# EAGLE schematic fet-dd-charger-20mm-mk-1.0-top (EAGLE 7.5.0)
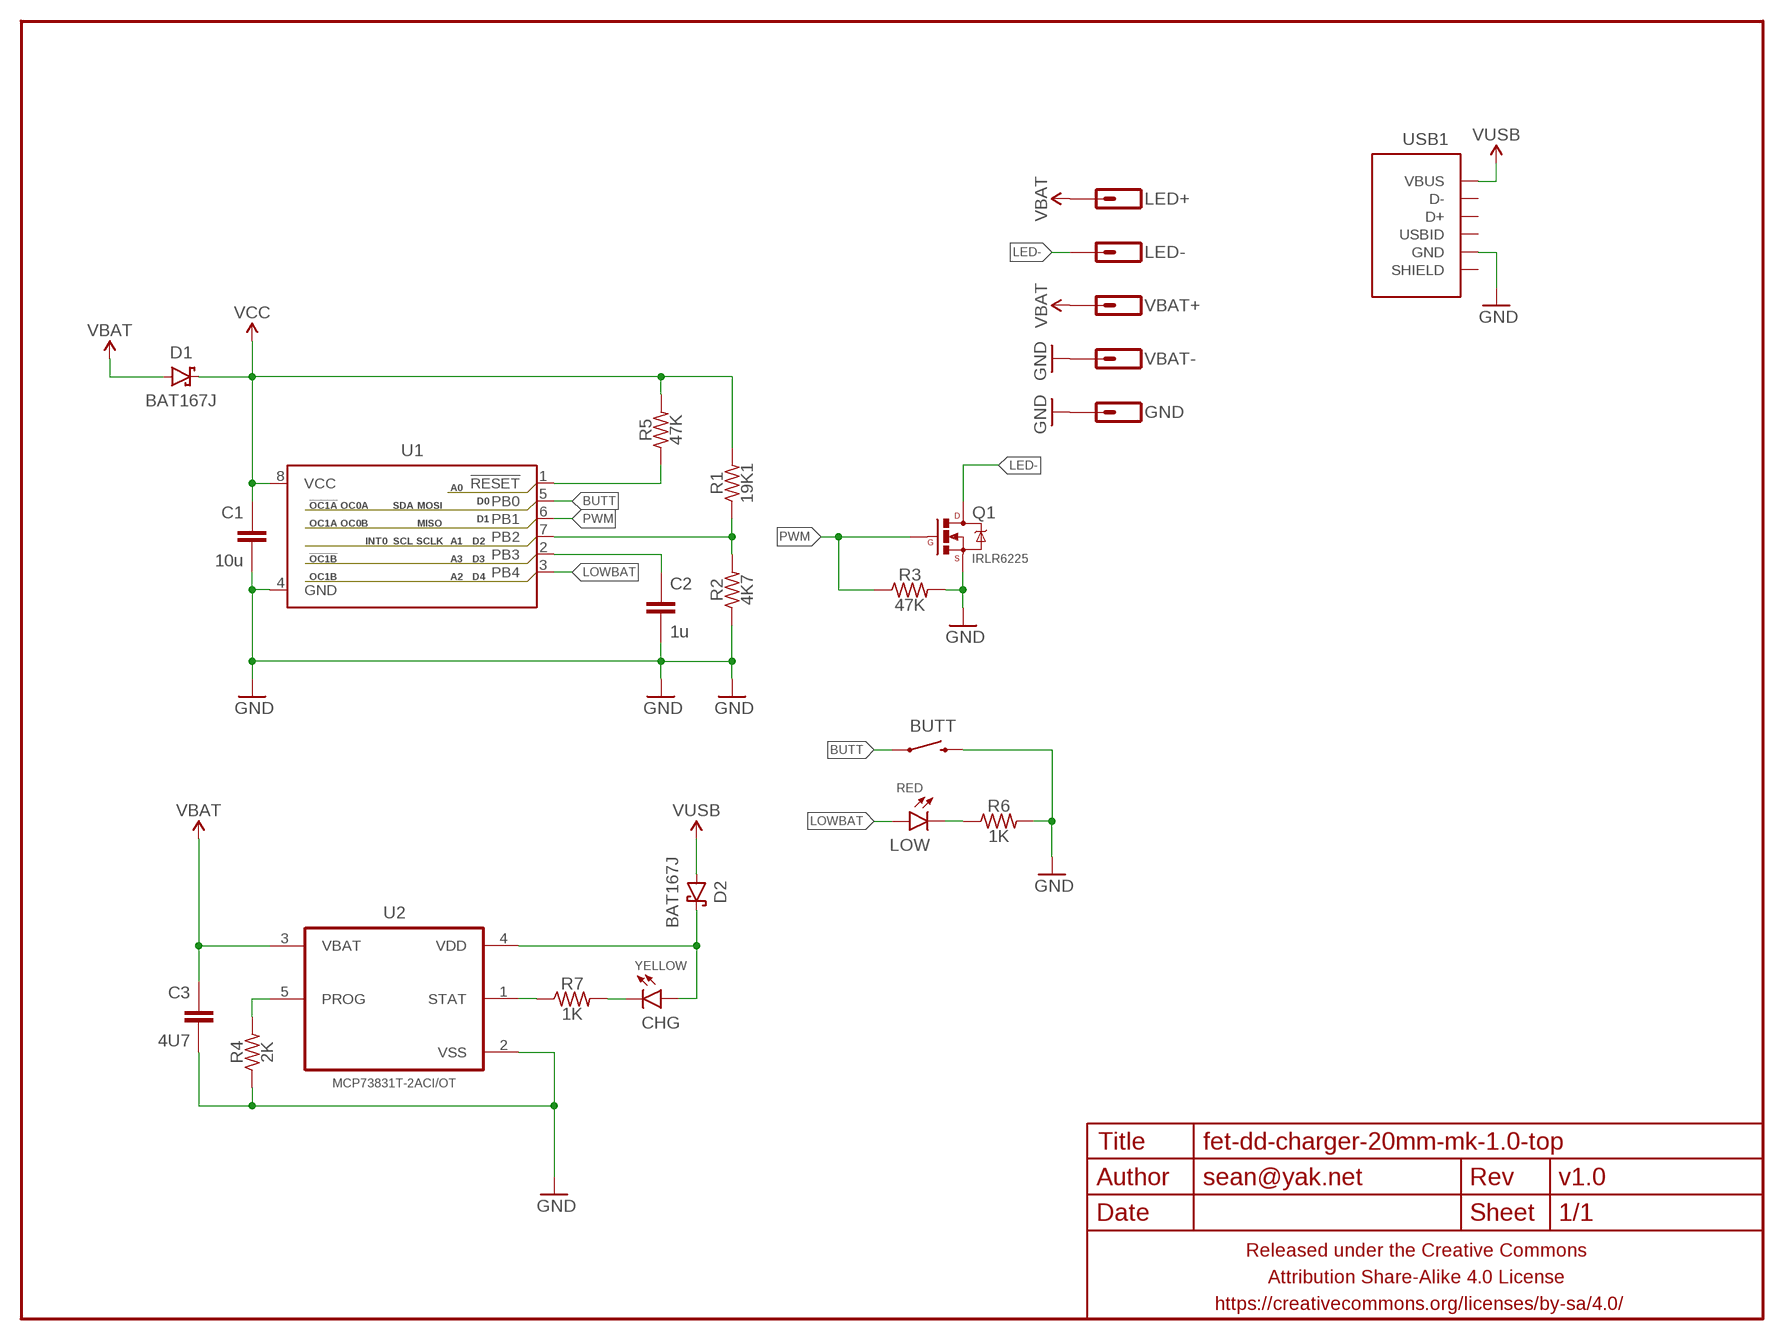
[diagram p0: schematic, sheet 1]

## Parts
BUTT  SWITCH-MOMENTARY-2PTH-RA  [TACTILE-PTH-SIDE]
C1  10u  CAPACITOR-CERAMICC0603-TIGHTER  [C0603-TIGHTER]
C2  1u  CAPACITOR-CERAMICC0603-TIGHTER  [C0603-TIGHTER]
C3  4U7  CAPACITOR-CERAMICC0603-TIGHTER  [C0603-TIGHTER]
CHG  YELLOW  LED0603-TIGHT  [LED-0603-TIGHT]
D1  BAT167J  DIODE-SCHOTTKYSOD323  [SOD323-SCHOTTKY]
D2  BAT167J  DIODE-SCHOTTKYSOD323  [SOD323-SCHOTTKY]
FRAME1  FRAME-LETTERNO_PACKAGE  [DUMMY]
GND  M01PTH_2MM  [1X01_2MM]
LED+  M01PTH_2MM  [1X01_2MM]
LED-  M01PTH_2MM  [1X01_2MM]
LOW  RED  LED0603-TIGHT  [LED-0603-TIGHT]
Q1  IRLR6225  MOSFET-NCHANNELSOT-223-CLOSER  [SOT223-CLOSER]
R1  19K1  RESISTORR0603-TIGHTER  [R0603-TIGHTER]
R2  4K7  RESISTORR0603-TIGHTER  [R0603-TIGHTER]
R3  47K  RESISTORR0402  [R0402]
R4  2K  RESISTORR0603-TIGHTER  [R0603-TIGHTER]
R5  47K  RESISTORR0402  [R0402]
R6  1K  RESISTORR0603-TIGHTER  [R0603-TIGHTER]
R7  1K  RESISTORR0603-TIGHTER  [R0603-TIGHTER]
U1  ATTINY13SOIC-NARROWPADS  [SO08-NARROWER]
U2  MCP73831T-2ACI/OT  [SOT95P280X145-5N]
USB1  USB-AB-SHIELDFCI-10118193-USB-MICRO-B  [FCI-10118193-USB-MICRO-B]
VBAT+  M01NOSTOP-CANTSTOP-DONTKNOWHOWTOSTOP  [1X01_SMD_NOSTOP_NOSILK]
VBAT-  M01NOT-A-VIA-NOPE  [1X01_NOSILK_NOSTOP]

## Nets
BUTT: BUTT.1 U1.5(PB0)
GND: BUTT.2 C1.2 C2.2 C3.2 GND.1 Q1.3(S) R2.1 R3.2 R4.1 R6.2 U1.4(GND) U2.2(VSS) USB1.5(GND) VBAT-.P$1
LED-: LED-.1 Q1.2(D) Q1.4(D)
LOWBAT: LOW.A U1.3(PB4)
N$1: R5.1 U1.1(!RESET)
N$2: R1.1 R2.2 U1.7(PB2)
N$3: C2.1 U1.2(PB3)
N$4: R4.2 U2.5(PROG)
N$5: CHG.A D2.C U2.4(VDD)
N$6: LOW.C R6.1
N$8: CHG.C R7.2
N$9: R7.1 U2.1(STAT)
PWM: Q1.1(G) R3.1 U1.6(PB1)
VBAT: C3.1 D1.A LED+.1 U2.3(VBAT) VBAT+.1
VCC: C1.1 D1.C R1.2 R5.2 U1.8(VCC)
VUSB: D2.A USB1.1(VBUS)
Unconnected: USB1.2(D-) USB1.3(D+) USB1.4(USBID) USB1.SHIELD@1(SHIELD) USB1.SHIELD@2(SHIELD) USB1.SHIELD@3(SHIELD) USB1.SHIELD@4(SHIELD)

## Library data of the parts
BUTT = a_parts:SWITCH-MOMENTARY-2: Various NO switches- pushbuttons, reed, etc
C1-C3 = a_parts:CAPACITOR-CERAMIC: CAPACITOR, European symbol
CHG LOW = a_parts:LED: LEDs Standard schematic elements and footprints for 5mm, 3mm, 1206, and 0603 sized LEDs. 5mm - Spark Fun Electronics SKU : COM-00529 (and others)
D1 D2 = a_parts:DIODE-SCHOTTKY: Schottky diodes in SFE's production catalog BAT20J 1A 23V 0.62Vf RB751 120mA 40V 0.37Vf PMEG4005EJ 0.5A 40V 0.42Vf MBRA140 1A 40V 0.5Vf B340A 3A 40V SMA
FRAME1 = a_parts:FRAME-LETTER: Schematic Frame Standard 8.5x11 US Letter frame; DESIGNER: sean@yak.net; VERSION: v1.0
GND LED+ LED- VBAT+ VBAT- = a_parts:M01: Header 1 Standard 1-pin 0.1" header. Use with straight break away headers (SKU : PRT-00116), right angle break away headers (PRT-00553), swiss pins (PRT-00743), machine pins (PRT-00117), and female headers (PRT-00115).
Q1 = a_parts:MOSFET-NCHANNEL: Common NMOSFET Parts MFG P/N Store ID Prod ID FDD8780 TRANS-09984 SI7820DN TRANS-11055 FDS6630A IC-08089 2N7002PW TRANS-11151 FQP30N06L COM-10213 TRANS-10060 BSS123LT1G TRANS-08345 BSS138 TRANS-00830 BS170 2N7000
R1-R7 = a_parts:RESISTOR: RESISTOR, American symbol
U1 = a_parts:ATTINY13: Atmel 8-pin 1kB flash uC
U2 = a_parts:MCP73831T-2ACI/OT: Charge Management Controller; MPN: MCP73831T-2ACI/OT; OC_FARNELL: 1332158; OC_NEWARK: 56K7045; PACKAGE: SOT-5; SUPPLIER: Microchip
USB1 = a_parts:USB-AB-SHIELD